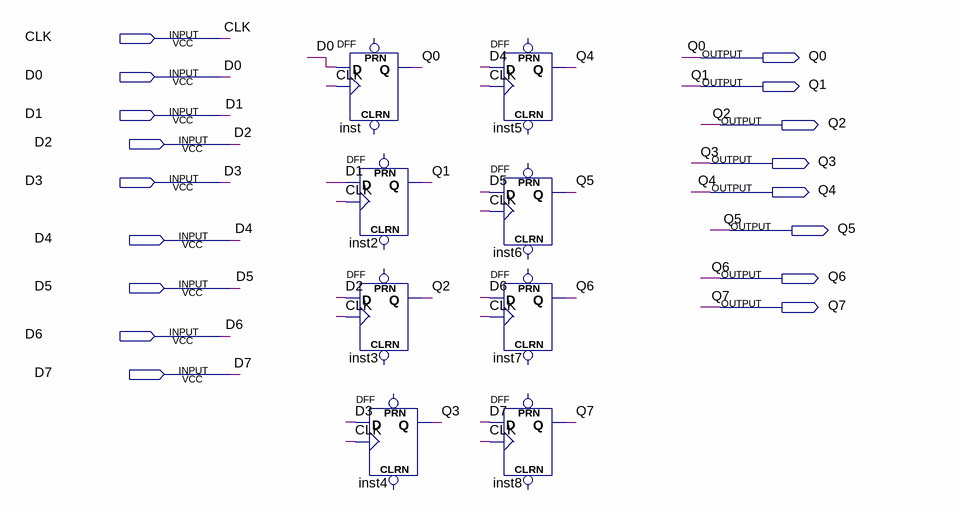
[diagram p0: schematic sheet]
// Quartus schematic Working.bdf as structural Verilog: 8 symbols, 17 pins
module Working (
  input  CLK,
  input  D0,
  input  D1,
  input  D2,
  input  D3,
  input  D4,
  input  D5,
  input  D6,
  input  D7,
  output Q0,
  output Q1,
  output Q2,
  output Q3,
  output Q4,
  output Q5,
  output Q6,
  output Q7
);

  DFF inst (.CLK(CLK), .D(D0), .Q(Q0));  // open: CLRN, PRN
  DFF inst2 (.CLK(CLK), .D(D1), .Q(Q1));  // open: CLRN, PRN
  DFF inst3 (.CLK(CLK), .D(D2), .Q(Q2));  // open: CLRN, PRN
  DFF inst4 (.CLK(CLK), .D(D3), .Q(Q3));  // open: CLRN, PRN
  DFF inst5 (.CLK(CLK), .D(D4), .Q(Q4));  // open: CLRN, PRN
  DFF inst6 (.CLK(CLK), .D(D5), .Q(Q5));  // open: CLRN, PRN
  DFF inst7 (.CLK(CLK), .D(D6), .Q(Q6));  // open: CLRN, PRN
  DFF inst8 (.CLK(CLK), .D(D7), .Q(Q7));  // open: CLRN, PRN
endmodule
